# Altium schematic sheet pilpal_final.SchDoc: Pillpal - Medicine Dispenser
size 420 x 297 mm; Date: 2024-05-02; CompanyName: Maveriks; DrawnBy: Shehan Perera; SheetNumber: 1; SheetTotal: 1
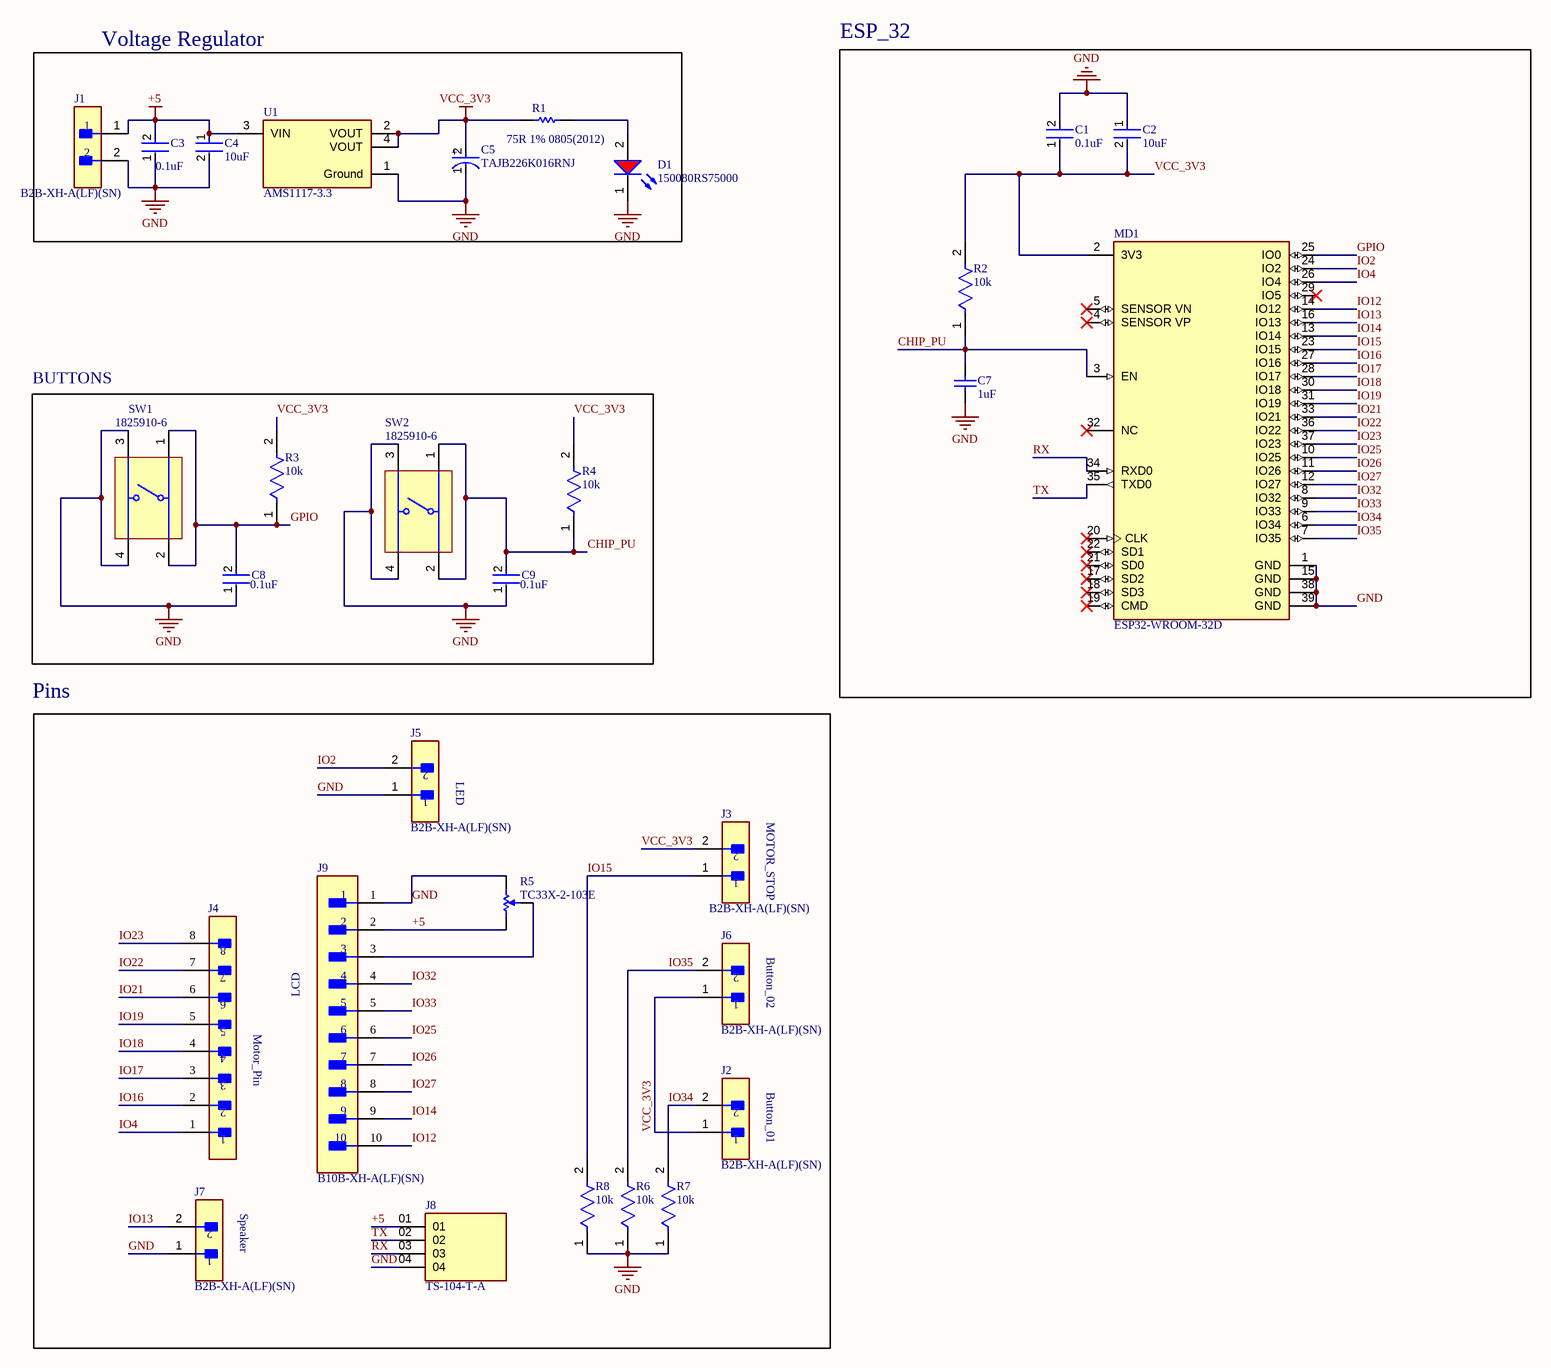
[diagram p0: pilpal_final.SchDoc]

## Parts
C1  0.1uF  [FP-GRM15-MFG]
C2  10uF  [FP-GRM188-0_1-e0_2_0_55-IPC_A]
C3  0.1uF  [FP-GRM15-MFG]
C4  10uF  [FP-GRM188-0_1-e0_2_0_55-IPC_A]
C5  TAJB226K016RNJ  [FP-TAJB-MFG]
C7  1uF  [CAPC2013X145X50ML20T25]
C8  0.1uF  [FP-GRM15-MFG]
C9  0.1uF  [FP-GRM15-MFG]
D1  150080RS75000  [WL-SMCW_0805_150080xx75000]
J1  B2B-XH-A(LF)(SN)  [FP-B2B-XH-A_LF_SN-MFG]
J2  B2B-XH-A(LF)(SN)  [FP-B2B-XH-A_LF_SN-MFG]
J3  B2B-XH-A(LF)(SN)  [FP-B2B-XH-A_LF_SN-MFG]
J4  B8B-XH-A(LF)(SN)  [FP-B8B-XH-A_LF_SN-MFG]  (value not drawn)
J5  B2B-XH-A(LF)(SN)  [FP-B2B-XH-A_LF_SN-MFG]
J6  B2B-XH-A(LF)(SN)  [FP-B2B-XH-A_LF_SN-MFG]
J7  B2B-XH-A(LF)(SN)  [FP-B2B-XH-A_LF_SN-MFG]
J8  TS-104-T-A  [SAMTEC_TS-104-T-A]
J9  B10B-XH-A(LF)(SN)  [FP-B10B-XH-A_LF_SN-MFG]
MD1  ESP32-WROOM-32D  [FP-ESP32-WROOM-32D-MFG]
R1  75R 1% 0805(2012)  [RESC0805(2012)_M]
R2  10k  [FP-CRG0805-IPC_C]
R3  10k  [FP-CRG0805-IPC_C]
R4  10k  [FP-CRG0805-IPC_C]
R5  TC33X-2-103E  [BOUR-TC33X-2_V]
R6  10k  [FP-CRG0805-IPC_C]
R7  10k  [FP-CRG0805-IPC_C]
R8  10k  [FP-CRG0805-IPC_C]
SW1  1825910-6  [TECO-1825910-6_V]
SW2  1825910-6  [TECO-1825910-6_V]
U1  AMS1117-3.3  [FP-AMS1117-IPC_C]

## Blocks framed on the sheet
Voltage Regulator: C3-C5 D1 J1 R1 U1
ESP_32: C1 C2 C7 MD1 R2
BUTTONS: C8 C9 R3 R4 SW1 SW2
Pins: J2-J9 R5-R8

## Nets
+5: C3.2 C4.1 J1.1 J8.01 J9.2 R5.1 U1.3(VIN)
GND: C1.2 C2.1 C3.1 C4.2 C5.1(C) C7.1 C8.1 C9.1 D1.1(K) J1.2 J5.1 J7.1 J8.04 J9.1 MD1.1(GND) MD1.15(GND) MD1.38(GND) MD1.39(GND) R5.3 R6.1 R7.1 R8.1 SW1.3 SW1.4 SW2.3 SW2.4 U1.1(Ground)
VCC_3V3: C1.1 C2.2 C5.2(A) J2.1 J3.2 J6.1 MD1.2(3V3) R1.1 R2.2 R3.2 R4.2 U1.2(VOUT) U1.4(VOUT)
CHIP_PU: C7.2 C9.2 MD1.3(EN) R2.1 R4.1 SW2.1 SW2.2
GPIO: C8.2 MD1.25(IO0) R3.1 SW1.1 SW1.2
IO2: J5.2 MD1.24(IO2)
IO4: J4.1 MD1.26(IO4)
IO12: J9.10 MD1.14(IO12)
IO13: J7.2 MD1.16(IO13)
IO14: J9.9 MD1.13(IO14)
IO15: J3.1 MD1.23(IO15) R8.2
IO16: J4.2 MD1.27(IO16)
IO17: J4.3 MD1.28(IO17)
IO18: J4.4 MD1.30(IO18)
IO19: J4.5 MD1.31(IO19)
IO21: J4.6 MD1.33(IO21)
IO22: J4.7 MD1.36(IO22)
IO23: J4.8 MD1.37(IO23)
IO25: J9.6 MD1.10(IO25)
IO26: J9.7 MD1.11(IO26)
IO27: J9.8 MD1.12(IO27)
IO32: J9.4 MD1.8(IO32)
IO33: J9.5 MD1.9(IO33)
IO34: J2.2 MD1.6(IO34) R7.2
IO35: J6.2 MD1.7(IO35) R6.2
RX: J8.03 MD1.34(RXD0)
TX: J8.02 MD1.35(TXD0)
NetD1_2: D1.2(A) R1.2
NetJ9_3: J9.3 R5.2

Not connected (* = marked no-connect by the designer): MD1 4(SENSOR_VP)* 5(SENSOR_VN)* 17(SD2)* 18(SD3)* 19(CMD)* 20(CLK)* 21(SD0)* 22(SD1)* 29(IO5)* 32(NC)*

## Notes on the sheet
- (near J5) LED
- (near J3) MOTOR_STOP
- (near J6) Button_02
- LCD
- (near J4) Motor_Pin
- (near J2) Button_01
- (near J7) Speaker
- THIS DOCUMENT AND THE DATA DISCLOSED HEREIN OR
- HEREWITH IS THE PROPERTY OF ALTIUM LIMITED AND MAY
- DWG NO:
- REVISION
- REV:
- DESCRIPTION
- DATE
- APPROVED
- BE FREELY DISTRIBUTED IN WHOLE. NO RIGHTS ARE
- RESERVED OR EXPRESS OR IMPLIED WARANTEE GIVEN.
- ENG:
- APPROVALS
- PROJECT
- DSN:
- CHK:
- REFERENCE DOCUMENTS
- PROJECT REVISION:
- TITLE
- DOCUMENT REVISION:
- DESIGN ITEM:
- BOM:
- FAB DWG:
- PCB DWG:
- ASSY DWG:
- SCALE:
- A3
- SIZE
- CAGE CODE
- FILE NAME
- DWG NO.
- SHEET
- OF
- REV
- (in symbol CMP-2100-03689-2) +

## Library data of the parts
C1 C3 C8 C9 = CMP-2100-03641-2: CAP CER 0.1UF 16V X7R 0402; Manufacturer Part Number: GRM155R71C104KA88D; Manufacturer: Murata; Standoff Height: 0mm; Tolerance: 10%; Voltage Rating: 16Vdc; Material: Ceramic; Capacitance: 0.10μF; Value: 0.10μF; RoHS: TRUE; Temperature Characteristic: X7R; Octopart: https://octopart.com/grm155r71c104ka88d-murata-196880; Digikey Description: CAP CER 0.1UF 16V X7R 0402; Device Class L3: Ceramic Capacitors; Height: 0.55mm; ComponentLink2Description: Datasheet; Temperature Range Low: -55°C; Ipc Land Pattern Name: CAPC10050X219; ComponentLink2URL: https://search.murata.co.jp/Ceramy/image/img/A01X/G101/ENG/GRM155R71H471KA01-01A.pdf; Device Class L1: Passive Components; Lead Free: yes; Category: Cap; Package: GRM15; Temperature: -55°C to +125°C; Device Class L2: Capacitors; Temperature Range High: +125°C; Mouser Description: 0402 0.1 uF 16V ±10 % Tolerance X7R SMT Multilayer Ceramic Capacitor
C2 C4 = CMP-2006-02792-2: Chip Multilayer Ceramic Capacitors for General Purpose, 0603, 10uF, X5R, 15%, 20%, 6.3V; Packaging: Tape and Reel; Voltage Rating (DC): 6.3V; Width: 0.031inch; Termination: SMD/SMT; Dielectric: X5R; Package Quantity: 4000; Voltage Rating: 6.3V; Capacitance: 10uF; Case/Package: 0603; Min Operating Temperature: -55°C; Voltage: 6.3V; Length: 1.6mm; Thickness: 0.035inch; Lead Free: Lead Free; Depth: 0.8mm; Case Code (Imperial): 0603; Max Operating Temperature: 85°C; Material: Ceramic; Height: 0.8mm; Tolerance: 20%; Mount: Surface Mount; REACH SVHC: No SVHC; Radiation Hardening: No; Case Code (Metric): 1608
C5 = CMP-2100-03689-2: 22uF 16V  ±10% 2.3Ω 1210  SMD Tantalum Capacitor; Leakage Current: 3.5uA; ESR (Equivalent Series Resistance): 2.3R; Dissipation Factor: 6%; Polarity: Polar; Series: TAJ; Termination: SMD/SMT; Voltage: 16V; Max Operating Temperature: 125°C; Height - Seated (Max): 0.083inch; Height: 1.9mm; Packaging: Tape and Reel; Voltage Rating: 16V; Features: General Purpose; Tolerance: 10%; Construction: Flat; Lead Free: Lead Free; Width: 2.8mm; REACH SVHC: No SVHC; Capacitance: 22uF; Length: 3.5mm; Mount: Surface Mount; Depth: 2.8mm; Voltage Rating (DC): 16V; Case/Package: 1210; Case Code (Metric): 3528; Package Quantity: 1; Radiation Hardening: No; Min Operating Temperature: -55°C; Number of Pins: 2; RoHS Compliant: Yes; Dielectric Material: Tantalum; Case Code (Imperial): 1210
C7 = CMP-1036-04731-2: Part Number: C0805C105K9PACTU; Manufacturer: Kemet
D1 = CMP-1426-00011-2: NexarPartId: 29717781; Peak Wavelength: 630nm; Wavelength: 625nm; Viewing Angle: 140°; Test Current: 20mA; Forward Voltage: 2V; Forward Current: 100mA; Lens Style: Clear, Rectangular; Color: Red; Luminous Intensity: 150mcd; Max Reverse Voltage (DC): 5V; Length: 2mm; Case Code (Imperial): 0805; RoHS: Compliant; Max Operating Temperature: 85°C; Height: 700µm; Packaging: Tape and Reel; Case/Package: 0805; REACH SVHC: Unknown; Dominant Wavelength: 625nm; Min Operating Temperature: -40°C; Case Code (Metric): 2012; Mount: Surface Mount; Width: 1.25mm
J1-J3 J5-J7 = CMP-2000-05888-3: CONN HEADER VERT 2POS 2.5MM; Current Rating: 3A; Voltage Rating: 250V; Number of Contacts: 2; Contact Resistance: 20mR; Wire/Cable Gauge: 22AWG; Insulation Resistance: 1GR; Connector Type: Male Pin; Packaging: Bulk; Contact Material: Brass; Lead Free: Lead Free; Orientation: Straight; Contact Plating: Tin; Max Current Rating: 3A; Termination: Solder; Fastening Type: Detent; Depth: 5.75mm; Housing Material: Polyamide; REACH SVHC: No SVHC; Series: XH; Voltage Rating (AC): 250V; Number of Positions: 2; Color: Natural; Contact Type: Male Pin; Max Voltage Rating (DC): 250V; Pitch: 2.5mm; Lead Pitch: 2.5mm; Mount: Through Hole; Max Operating Temperature: 85°C; Length: 7.4mm; Max Voltage Rating (AC): 250V; Min Operating Temperature: -25°C; Number of Rows: 1; Housing Color: White
J4 = CMP-17438-000015-1: CONN HEADER VERT 8POS 2.5MM; Voltage Rating (AC): 250V; Insulation Resistance: 1GR; Connector Type: Male Pin; Max Current Rating: 3A; Wire/Cable Gauge: 22AWG; Number of Contacts: 8; Contact Resistance: 20mR; Orientation: Straight; Pitch: 2.5mm; Min Operating Temperature: -25°C; Number of Rows: 1; Contact Type: Male Pin; Packaging: Bulk; Lead Free: Lead Free; Max Operating Temperature: 85°C; Housing Material: Polyamide; Voltage Rating: 250V; Series: XH; Mount: Through Hole; Depth: 5.75mm; Contact Material: Brass; Fastening Type: Detent; Color: Natural; Max Voltage Rating (AC): 250V; Number of Positions: 8; Housing Color: White; Contact Plating: Tin; Lead Pitch: 2.5mm; Length: 22.4mm; REACH SVHC: No SVHC; Termination: Press-Fit; Current Rating: 3A
J8 = TS-104-T-A: TS - Samtec 2.54mm Single Row Machined Terminal Strip - Fast Stock; MF: Samtec Inc.; Check_prices: https://www.snapeda.com/parts/TS-104-T-A/Samtec+Inc./view-part/?ref=eda; Value: *; Availability: In Stock; Price: None; Package: None; MP: TS-104-T-A; SnapEDA_Link: https://www.snapeda.com/parts/TS-104-T-A/Samtec+Inc./view-part/?ref=snap; Purchase-URL: https://pricing.snapeda.com/search/part/TS-104-T-A/?ref=eda; Supplier 1: Digikey; Supplier Part Number 1: SAM1112-04-ND
J9 = CMP-17439-000145-1: CONN HEADER VERT 10POS 2.5MM; Voltage Rating: 250V; Current Rating: 3A; Wire/Cable Gauge: 22AWG; Number of Contacts: 10; Contact Resistance: 20mR; Mated Stacking Heights: 9.8mm; Gender: Male; Insulation Resistance: 1GR; Series: XH; Max Current Rating: 3A; Contact Shape: Square; Contact Material: Brass; Housing Material: Polyamide; Lead Free: Lead Free; Orientation: Straight; Max Voltage Rating (DC): 250V; Contact Type: Male Pin; Number of Positions: 10; Length: 27.4mm; Housing Color: White; Max Voltage Rating (AC): 250V; Depth: 5.75mm; Mount: Through Hole; Pitch: 2.5mm; Fastening Type: Detent; Flammability Rating: UL94 V-0; Color: Natural; Contact Plating: Tin; Insulation Color: Natural; Packaging: Bulk; REACH SVHC: No SVHC; Insulation Material: Nylon; Connector Type: Header; Lead Pitch: 2.5mm; Contact Finish - Mating: TIN; Voltage Rating (AC): 250V; Number of Rows: 1; Max Operating Temperature: 85°C; Min Operating Temperature: -25°C; Termination: Solder
MD1 = CMP-194065-000003-1: WIFI MODULE 32MBITS SPI FLASH; Manufacturer: Espressif Systems; Max Supply Voltage: 3.6V; Nominal Supply Current: 500mA; Max Frequency: 2484MHz; Number Of Adc Channels: 16; Number Of Gpio: 32; Interface: I2C,SPI,UART,Ethernet,I2S,Other; Data Rate: 150Mbits/s; Min Supply Voltage: 3V; Bandwidth: 72MHz; Sensitivity: -98dBm; Octopart: https://octopart.com/esp32-wroom-32d-espressif+systems-91040050; Package: ESP32-WROOM-32D; ComponentLink2URL: https://www.espressif.com/sites/default/files/documentation/esp32-wroom-32d_esp32-wroom-32u_datasheet_en.pdf; Lead Free: Yes; Category: UNK; Mouser Description: Wi-Fi/BT BLE Module ESP32-D0WD, SPI Flash, UART, P; Device Class L1: Integrated Circuits (ICs); RoHS: TRUE; Temperature Range Low: -40°C; ComponentLink2Description: Datasheet; Digikey Description: WIFI MODULE 32MBITS SPI FLASH; Height: 3.2mm; Temperature: -40°C to +85°C; Manufacturer Part Number: ESP32-WROOM-32D; Device Class L3: Transceivers; Device Class L2: RF Semiconductors and Devices; Temperature Range High: +85°C; Automotive: No
R1 = CMP-1013-00383-1: 75R 0.125W 1% 0805 (2012 Metric)  SMD; Case-EIA: 0805; Case-Metric: 2012; Value: 75.00 Ohm; Technology: SMT; Tolerance: 1 %; Power: 0.125 W
R2-R4 R6-R8 = CMP-03211-011401-1: RES SMD 10K OHM 1% 1/8W 0805; Temperature Coefficient: 100ppm/°C; Power Rating: 125mW; Resistance: 10kR; Voltage Rating: 150V; Number of Resistors: 1; RoHS Compliant: Yes; Tolerance: 1%; Mount: Surface Mount; Radiation Hardening: No; Depth: 1.25mm; Termination: Solder; Series: CRG Series; Packaging: Tape and Reel; Number of Terminations: 2; Resistor Type: Thick Film; Length: 2mm; Height: 0.55mm; ELV: Compliant; Case/Package: 0805; Min Operating Temperature: -55°C; Max Operating Temperature: 125°C; Technology: THICK FILM
R5 = CMP-2100-03695-1: Trimming Potentiometer, 10000 Ohm, -40 to 100 degC, 3-Pin SMD, RoHS, Tape and Reel; Manufacturer: Bourns; Tolerance: 25%; Max Power Dissipation: 100mW; Number of Turns: 1; Resistance: 10KOhm; Temperature Coefficient: 250ppm/degreesC; Voltage Rating (DC): 50V; Datasheet URL: http://www.bourns.com/docs/Product-Datasheets/TC33.pdf; Composition: Potentiometer; Package Description: 3-Pin Surface Mount Device, Body 3.8 x 3.6 mm; Weight: 29.4mg; Power Rating: 100mW; Termination: FootPrint; Manufacturer URL: http://www.bourns.com/; Width: 0.118inch; Height: 0.047inch; Military Standard: Not; Radiation Hardening: No; Colour: Silver; Case/Package: SMD/SMT; Depth: 3.8mm; Min Operating Temperature: -40degC; Lead Free: LeadFree; Datasheet Version: 42583.0; REACH SVHC: NoSVHC; Length: 3mm; RoHSCompliant: true; Contact Plating: Silver; Taper: Linear; Packaging: TapeandReel; Mount: SurfaceMount; Max Operating Temperature: 100degC; Package Reference: TC33X-2; Package Quantity: 2500
SW1 SW2 = CMP-1684-00021-1: Tact Switch, SPST-NO, 0.05 A, -35 to 85 degC, 4-Pin THD, RoHS, Bulk; Manufacturer: TE Connectivity; Maximum Contact Resistance: 100mOhm; Mechanical Life: 100000Cycles; Bushing Type: Unthreaded; Switch Configuration: OFF(ON); Maximum DC Voltage Rating: 24V; Contact Rating @ Voltage: 0.05A@24VDC; Actuator Color: Black; Body Orientation: Straight; Function: MomentaryContact; Illumination: N/R; Actuator Style: RoundButton; Actuator Material: PolybutyleneTerephthalate; Dielectric Strength: 500VAC; Pole Throw Configuration: SPST; Actuator Length: 1.4mm; Product Weight: N/A; Contact Material: CopperAlloy; Housing Material: N/A; Terminal Type: PCPins; Minimum Insulation Resistance: 100MOhm; Package Description: 4-Pin Through Hole Device, Body 5.99 x 5.99 mm, Pitch 6.5 mm; Part No: 1825910-6; Package Reference: THD; Base Material: N/A; Manufacturer URL: http://www.te.com; Contact Plating: Silver; RoHS: Yes; Datasheet Version: Rev. C9; Electrical Life: 100000Cycles; Maximum AC Voltage Rating: N/A; Thread Size: N/R; Operating Temperature: -35to85C; Mounting: ThroughHole; Dimension: 5.99x5mm; Datasheet URL: http://www.te.com/commerce/DocumentDelivery/DDEController?Action=showdoc&DocId=Customer+Drawing%7F1825910%7FC9%7Fpdf%7FEnglish%7FENG_CD_1825910_C9.pdf%7F1825910-6; Family: 1825910; Seal Location: N/A; Seal Description: N/A; Packaging: N/A
U1 = CMP-209535-000001-1: LDO Voltage Regulators 1A, 3.3V; Manufacturer: Advanced Monolithic Systems; Dropout Voltage: 1.1V; Output Type: Fixed; Nominal Supply Current: 5mA; Max Power Dissipation: 1.2W; Max Supply Voltage: 15V; Number Of Outputs: 1; Standoff Height: 0.64mm; Max Junction Temp: +125°C; Height: 1.8mm; Package: AMS1117; Device Class L2: Power Management ICs; ComponentLink2Description: Datasheet; ComponentLink2URL: http://www.advanced-monolithic.com/pdf/ds1117.pdf; Category: IC; RoHS: TRUE; Automotive: No; Device Class L1: Integrated Circuits (ICs); Output Current: 1A; Device Class L3: Voltage Regulators - Linear; Temperature: -40°C to +125°C; Output Voltage: 3.3V; Manufacturer Part Number: AMS1117-3.3; Temperature Range Low: -40°C; Octopart: https://octopart.com/ams1117-3.3-advanced+monolithic+systems-25899300; Lead Free: Yes; Ipc Land Pattern Name: SOT229P700X180-4; Temperature Range High: +125°C